# Altium schematic sheet FDCAN.SchDoc: FDCAN
size A4; Date: Not used; ApprovedBy: Not used; CheckedBy: Not used; Author: Not used; CompanyName: STMicroelectronics; DrawnBy: Not used; Engineer: Not used; Organization: Not used; Address1: Not used; Address2: Not used; Address3: Not used; Address4: Not used; DocumentNumber: Not used; Revision: Not used; SheetNumber: 10; SheetTotal: 18; CurrentTime: Not used; CurrentDate: Not used; Time: Not used; DocumentFullPathAndName: Not used; DocumentName: Not used; ModifiedDate: Not used; ImagePath: Not used; ProjectName: Not used; Application_BuildNumber: Not used
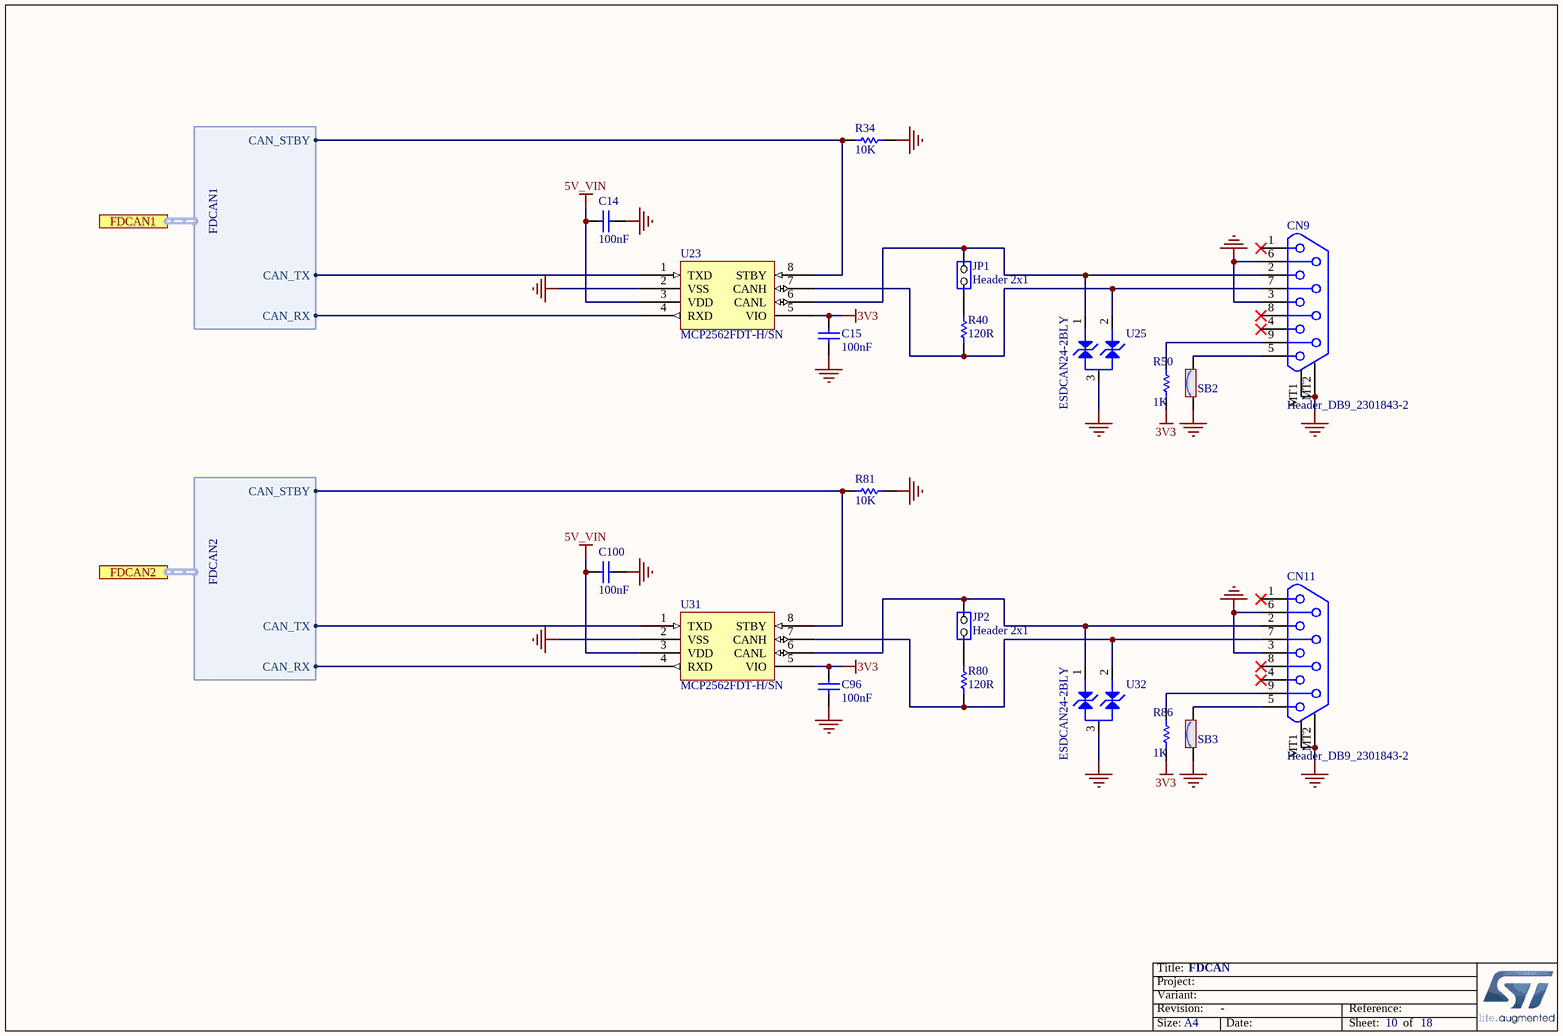
[diagram p0: FDCAN.SchDoc]

## Parts
C14  value 100nF  [C0402]  (hidden comment: Capacitor)
C15  value 100nF  [C0402]  (hidden comment: Capacitor)
C96  value 100nF  [C0402]  (hidden comment: Capacitor)
C100  value 100nF  [C0402]  (hidden comment: Capacitor)
CN9  value Header_DB9_2301843-2  [CON_DB9-MALE_TYCO_2301843-2]  (hidden comment: DB9_Header_male_2301843-2)
CN11  value Header_DB9_2301843-2  [CON_DB9-MALE_TYCO_2301843-2]  (hidden comment: DB9_Header_male_2301843-2)
JP1  value Header 2x1  [CON_SAMTEC_TSW-102-07-G-S]  (hidden comment: Jumper_Header 2x1)
JP2  value Header 2x1  [CON_SAMTEC_TSW-102-07-G-S]  (hidden comment: Jumper_Header 2x1)
R34  value 10K  [R0402]  (hidden comment: Resistor)
R40  value 120R  [R0402]  (hidden comment: Resistor)
R50  value 1K  [R0402]  (hidden comment: Resistor)
R80  value 120R  [R0402]  (hidden comment: Resistor)
R81  value 10K  [R0402]  (hidden comment: Resistor)
R86  value 1K  [R0402]  (hidden comment: Resistor)
SB2  SB_ON  [SOLDER-BRIDGE_R0402-0R]  (value not drawn)
SB3  SB_ON  [SOLDER-BRIDGE_R0402-0R]  (value not drawn)
U23  value MCP2562FDT-H/SN  [ICC_SO8_5X4_P127]  (hidden comment: MCP2562FD)
U25  value ESDCAN24-2BLY  [ESD_SOT23]  (hidden comment: ESD-TRANSIL-DUAL-BIDIR)
U31  value MCP2562FDT-H/SN  [ICC_SO8_5X4_P127]  (hidden comment: MCP2562FD)
U32  value ESDCAN24-2BLY  [ESD_SOT23]  (hidden comment: ESD-TRANSIL-DUAL-BIDIR)

## Ports
FDCAN1 (harness FDCAN1), FDCAN2 (harness FDCAN2)

## Harnesses
FDCAN1: CAN_TX, CAN_RX, CAN_STBY
FDCAN2: CAN_TX, CAN_RX, CAN_STBY

## Nets
3V3: C15.2 C96.2 R50.1 R86.1 U23.5(VIO) U31.5(VIO)
5V_VIN: C14.1 C100.1 U23.3(VDD) U31.3(VDD)
GND: C14.2 C15.1 C96.1 C100.2 CN9.3 CN9.6 CN9.MT1 CN9.MT2 CN11.3 CN11.6 CN11.MT1 CN11.MT2 R34.2 R81.2 SB2.1 SB3.1 U23.2(VSS) U25.3 U31.2(VSS) U32.3
NetCN9_2: CN9.2 JP1.2(NO) U23.6(CANL) U25.1
NetCN9_5: CN9.5 SB2.2
NetCN9_7: CN9.7 R40.1 U23.7(CANH) U25.2
NetCN9_9: CN9.9 R50.2
NetCN11_2: CN11.2 JP2.2(NO) U31.6(CANL) U32.1
NetCN11_5: CN11.5 SB3.2
NetCN11_7: CN11.7 R80.1 U31.7(CANH) U32.2
NetCN11_9: CN11.9 R86.2
NetJP1_1: JP1.1(COMMON) R40.2
NetJP2_1: JP2.1(COMMON) R80.2
NetR34_1: R34.1 U23.8(STBY) ; port FDCAN1.CAN_STBY
NetR81_1: R81.1 U31.8(STBY) ; port FDCAN2.CAN_STBY
NetU23_1: U23.1(TXD) ; port FDCAN1.CAN_TX
NetU23_4: U23.4(RXD) ; port FDCAN1.CAN_RX
NetU31_1: U31.1(TXD) ; port FDCAN2.CAN_TX
NetU31_4: U31.4(RXD) ; port FDCAN2.CAN_RX

Not connected (* = marked no-connect by the designer): CN9 1* 4* 8*; CN11 1* 4* 8*

## Notes on the sheet
- Title:
- Project:
- Size:
- Revision:
- Variant:
- A4
- -
- Date:
- Reference:
- Sheet:
- of

## Library data of the parts
C14 C15 C96 C100 = MCD-00006: Capacitor, MLCC, 100nF, 16V, X7R, +/-10%, 0402, T=0.5mm; Part_Preference: Recommended; Manufacturer: YAGEO; Manufacturer_Part_Number: CC0402KRX7R7BB104; Order_Code_RS: 616-9701; Component_Country_Of_Origin: China; ShowFields: YES; ID: 2474; Internal_Part_Number: MCD-00006; Status: Released; Part_Type: Capacitor; Package: 0402; ComponentLink1URL: http://tunmcdsvn.tun.st.com/Component_Documentation_Library/Trunk/Capacitor/YAGEO_X7R_Series; Order_Code_Digikey: 311-1338-1-ND; Order_Code_Farnell: 9402047
CN9 CN11 = MCD-01978: Connector_DB9-Male, 9pins, 1.39mm, RA, TH, T= 13.575mm/3.8mm; Part_Preference: Recommended; Manufacturer: TE CONNECTIVITY; Component_Country_Of_Origin: China; ShowFields: YES; ID: 4078; Internal_Part_Number: MCD-01978; Status: Released; Part_Type: Connector; Manufacturer_Part_Number: 2301843-2; Package: TH; ComponentLink1URL: http://tunmcdsvn.tun.st.com/Component_Documentation_Library/Trunk/Connector/TYCO_2301843-2/; Order_Code_Digikey: A132511-ND; Order_Code_Farnell: 2857983; Order_Code_RS: N/A
JP1 JP2 = MCD-00045: Header, 2x1, 2,54mm, VR, TH, Height 5.84mm/2.54mm; Part_Type: Connector; Manufacturer_Part_Number: TSW-102-07-G-S; Manufacturer: SAMTEC; Alternate_Manufacturer_Part_Number: 313102S111116;313102S111116; Alternate_Manufacturer: JIUBABA; LIANYI; Alternate_Internal_Part_Number: MCD-02390; Part_Preference: Recommended; Provided_By: SUBCO; Component_Country_Of_Origin: China, Costa Rica, Malaysia, United States, Vietnam; ID: 2545; Order_Code_RS: 155-5312; ShowFields: YES; Internal_Part_Number: MCD-00045; Status: Released; ComponentLink1Description: Datasheet; ComponentLink1URL: http://tunmcdsvn.tun.st.com/Component_Documentation_Library/Trunk/Connector/SAMTEC_TSW_Series/; Order_Code_Digikey: SAM1029-02-ND; Order_Code_Farnell: 2505044
R34 R81 = MCD-00053: Resistor,10K,0402,1%,1/16W; Manufacturer_Part_Number: RC0402FR-0710KL; Manufacturer: YAGEO; BMS_Part_Number: 9131590; Part_Preference: Recommended; Provided_By: SUBCO; Component_Country_Of_Origin: China; ID: 2539; ShowFields: YES; Internal_Part_Number: MCD-00053; Status: Released; Part_Type: Resistor; Package: 0402; ComponentLink1Description: Datasheet; ComponentLink1URL: http://tunmcdsvn.tun.st.com/Component_Documentation_Library/Trunk/Resistor/YAGEO_RC_L_Series; Order_Code_Digikey: 311-10.0KLRCT-ND; Order_Code_Farnell: 9239359; Order_Code_RS: N/A
R40 R80 = MCD-00194: Resistor, 120R, 0402, +/-1%, 1/16W; Part_Preference: Recommended; Manufacturer: YAGEO; Manufacturer_Part_Number: RC0402FR-07120RL; Component_Country_Of_Origin: China; ShowFields: YES; ID: 2674; Internal_Part_Number: MCD-00194; Status: Released; Part_Type: Resistor; Package: 0402; ComponentLink1URL: http://tunmcdsvn.tun.st.com/Component_Documentation_Library/Trunk/Resistor/YAGEO_RC_L_Series; Order_Code_Digikey: 311-120LRCT-ND; Order_Code_Farnell: 9239120; Order_Code_RS: N/A
R50 R86 = MCD-00061: Resistor,1K,0402,1%,1/16W; Manufacturer_Part_Number: RC0402FR-071KL; Manufacturer: YAGEO; Part_Preference: Recommended; Provided_By: SUBCO; Component_Country_Of_Origin: China; ID: 2532; ShowFields: YES; Internal_Part_Number: MCD-00061; Status: Released; Part_Type: Resistor; Package: 0402; ComponentLink1Description: Datasheet; ComponentLink1URL: http://tunmcdsvn.tun.st.com/Component_Documentation_Library/Trunk/Resistor/YAGEO_RC_L_Series; Order_Code_Digikey: 311-1.00KLRCT-ND; Order_Code_Farnell: 9239235; Order_Code_RS: N/A
SB2 SB3 = MCD-01618: Solder Bridge 0402 ON; Part_Type: Misc; Manufacturer_Part_Number: RC0402JR-070RL; Manufacturer: YAGEO; Part_Preference: Recommended; Provided_By: SUBCO; Component_Country_Of_Origin: China; ID: 3718; Order_Code_RS: 618-5804; ShowFields: YES; Internal_Part_Number: MCD-01618; Status: Released; Package: SB0402; ComponentLink1Description: Datasheet; ComponentLink1URL: http://tunmcdsvn.tun.st.com/Component_Datasheet_Library/Trunk/Resistors/Yageo_Resistor_RC0402-series; Order_Code_Digikey: 311-0.0JRTR-ND; Order_Code_Farnell: 2363467
U23 U31 = MCD-00129: High-Speed CAN Flexible Data Rate Transceiver; Part_Type: IC; Manufacturer: MICROCHIP; Part_Preference: Recommended; Provided_By: SUBCO; Component_Country_Of_Origin: Unknown; ID: 2737; ShowFields: YES; Internal_Part_Number: MCD-00129; Status: Released; Manufacturer_Part_Number: MCP2562FDT-H/SN; ComponentLink1Description: Datasheet; ComponentLink1URL: http://tunmcdsvn.tun.st.com/Component_Datasheet_Library/Trunk/IC/Microchip_CAN Transceiver_MCP2562FD; Order_Code_Digikey: N/A; Order_Code_Farnell: N/A; Order_Code_RS: N/A
U25 U32 = MCD-00143: Automotive dual-line Transil. ESD CAN; Part_Type: IC; Manufacturer: STMICROELECTRONICS; BMS_Part_Number: 9179002; Manufacturer_HQ_COO: EU; Part_Preference: Recommended; Provided_By: SUBCO with ST control; Component_Country_Of_Origin: China; ID: 2726; ShowFields: YES; Internal_Part_Number: MCD-00143; Status: Released; Manufacturer_Part_Number: ESDCAN24-2BLY; ComponentLink1Description: Datasheet; ComponentLink1URL: http://tunmcdsvn.tun.st.com/Component_Datasheet_Library/Trunk/Diodes/STM_ESD CAN_ESDCAN24-2BLY; Order_Code_Digikey: N/A; Order_Code_Farnell: N/A; Order_Code_RS: N/A